# EAGLE design vfd_controller_io (EAGLE 9.6.1)
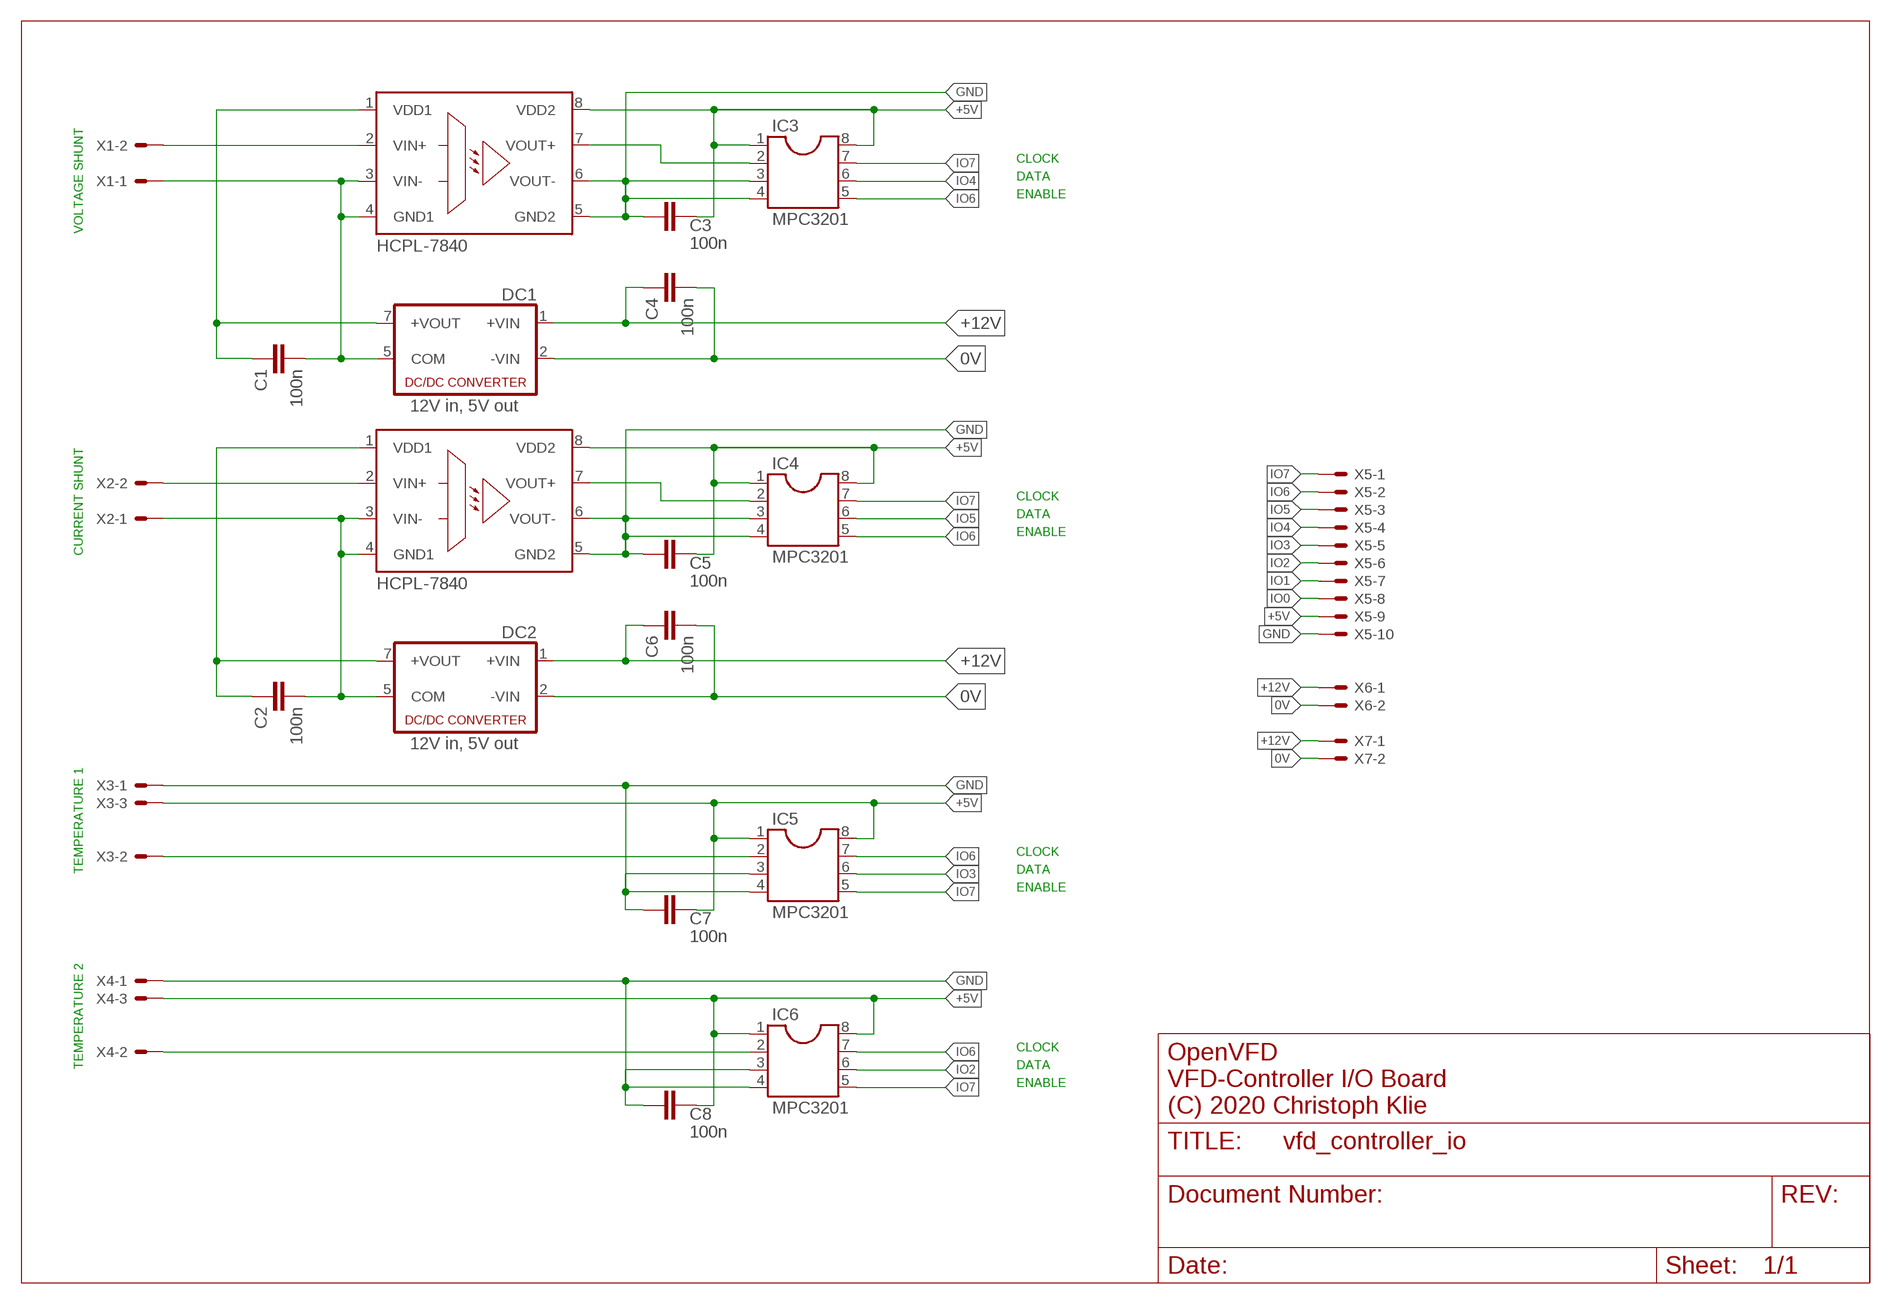
[diagram p0: schematic, sheet 1]

## Parts
C1  100n  C-EU050-025X075  [C050-025X075]
C2  100n  C-EU050-025X075  [C050-025X075]
C3  100n  C-EU050-025X075  [C050-025X075]
C4  100n  C-EU025-024X044  [C025-024X044]
C5  100n  C-EU050-025X075  [C050-025X075]
C6  100n  C-EU025-024X044  [C025-024X044]
C7  100n  C-EU050-025X075  [C050-025X075]
C8  100n  C-EU050-025X075  [C050-025X075]
DC1  12V in, 5V out  MEV  [MEV]
DC2  12V in, 5V out  MEV  [MEV]
IC1  HCPL-7840  HCPL-7800  [DIL08]
IC2  HCPL-7840  HCPL-7800  [DIL08]
IC3  MPC3201  DIL8  [DIL08]
IC4  MPC3201  DIL8  [DIL08]
IC5  MPC3201  DIL8  [DIL08]
IC6  MPC3201  DIL8  [DIL08]
X1  JST-XH-02-PIN-LONG-PAD  [JST-XH-02-PACKAGE-LONG-PAD]
X2  JST-XH-02-PIN-LONG-PAD  [JST-XH-02-PACKAGE-LONG-PAD]
X3  JST-XH-03-PIN-LONG-PAD  [JST-XH-03-PACKAGE-LONG-PAD]
X4  JST-XH-03-PIN-LONG-PAD  [JST-XH-03-PACKAGE-LONG-PAD]
X5  JST-XH-10-PIN-LONG-PAD  [JST-XH-10-PACKAGE-LONG-PAD]
X6  JST-XH-02-PIN-LONG-PAD  [JST-XH-02-PACKAGE-LONG-PAD]
X7  JST-XH-02-PIN-LONG-PAD  [JST-XH-02-PACKAGE-LONG-PAD]

## Nets
0V: C4.2 C6.2 DC1.2(-VIN) DC2.2(-VIN) X6.2 X7.2
+5V: C3.2 C5.2 C7.2 C8.2 IC1.8(VDD2) IC2.8(VDD2) IC3.1 IC3.8 IC4.1 IC4.8 IC5.1 IC5.8 IC6.1 IC6.8 X3.3 X4.3 X5.9
+12V: C4.1 C6.1 DC1.1(+VIN) DC2.1(+VIN) X6.1 X7.1
GND: C3.1 C5.1 C7.1 C8.1 IC1.5(GND2) IC1.6(VOUT-) IC2.5(GND2) IC2.6(VOUT-) IC3.3 IC3.4 IC4.3 IC4.4 IC5.3 IC5.4 IC6.3 IC6.4 X3.1 X4.1 X5.10
IO0: X5.8
IO1: X5.7
IO2: IC6.6 X5.6
IO3: IC5.6 X5.5
IO4: IC3.6 X5.4
IO5: IC4.6 X5.3
IO6: IC3.5 IC4.5 IC5.7 IC6.7 X5.2
IO7: IC3.7 IC4.7 IC5.5 IC6.5 X5.1
N$2: IC6.2 X4.2
N$3: IC5.2 X3.2
N$5: C2.1 DC2.7(+VOUT) IC2.1(VDD1)
N$13: C2.2 DC2.5(COM) IC2.3(VIN-) IC2.4(GND1) X2.1
N$14: IC1.2(VIN+) X1.2
N$17: IC1.7(VOUT+) IC3.2
N$19: C1.2 DC1.5(COM) IC1.3(VIN-) IC1.4(GND1) X1.1
N$21: IC2.2(VIN+) X2.2
N$22: C1.1 DC1.7(+VOUT) IC1.1(VDD1)
N$32: IC2.7(VOUT+) IC4.2

## Notes on the sheet
- VOLTAGE SHUNT
- CLOCK
- DATA
- ENABLE
- CURRENT SHUNT
- CLOCK
- DATA
- ENABLE
- TEMPERATURE 1
- CLOCK
- DATA
- ENABLE
- TEMPERATURE 2
- CLOCK
- OpenVFD
- DATA
- ENABLE | VFD-Controller I/O Board
- (C) 2020 Christoph Klie

## Library data of the parts
C1-C3 C5 C7 C8 = rcl:C-EU: CAPACITOR, European symbol; R: MKS2-63 100N; SPICEPREFIX: C
C4 C6 = rcl:C-EU: CAPACITOR, European symbol; R: MKS02-63 100N; SPICEPREFIX: C
DC1 DC2 = custom:MEV: DC-DC CONVERTER; R: MEV1S1205SC
IC1 IC2 = avago:HCPL-7800: Isolation Amplifer Source: http://www.avagotech.com/docs/AV02-0410EN; MPN: HCPL-7800A#500; OC_FARNELL: 459446; OC_NEWARK: 05M6395
IC3-IC6 = ic-package:DIL8: Dual In Line / Socket; R: MPC 3201-CI/P
X1 X2 X6 X7 =  JST_XH_connnectors:JST-XH-02-PIN: JST XH Connector 2 Pin Wire to board connector. Pitch: 2,54 mm, (0.100") Number of pins: 2 Created by Rembrandt Electronics www.rembrandtelectronics.com; R: JST XH2P ST
X3 X4 =  JST_XH_connnectors:JST-XH-03-PIN: JST XH Connector 2 Pin Wire to board connector. Pitch: 2,54 mm, (0.100") Number of pins: 3 Created by Rembrandt Electronics www.rembrandtelectronics.com; R: JST XH3P ST
X5 =  JST_XH_connnectors:JST-XH-10-PIN: JST XH Connector 2 Pin Wire to board connector. Pitch: 2,54 mm, (0.100") Number of pins: 10 Created by Rembrandt Electronics www.rembrandtelectronics.com; R: JST XH10P ST

## Board
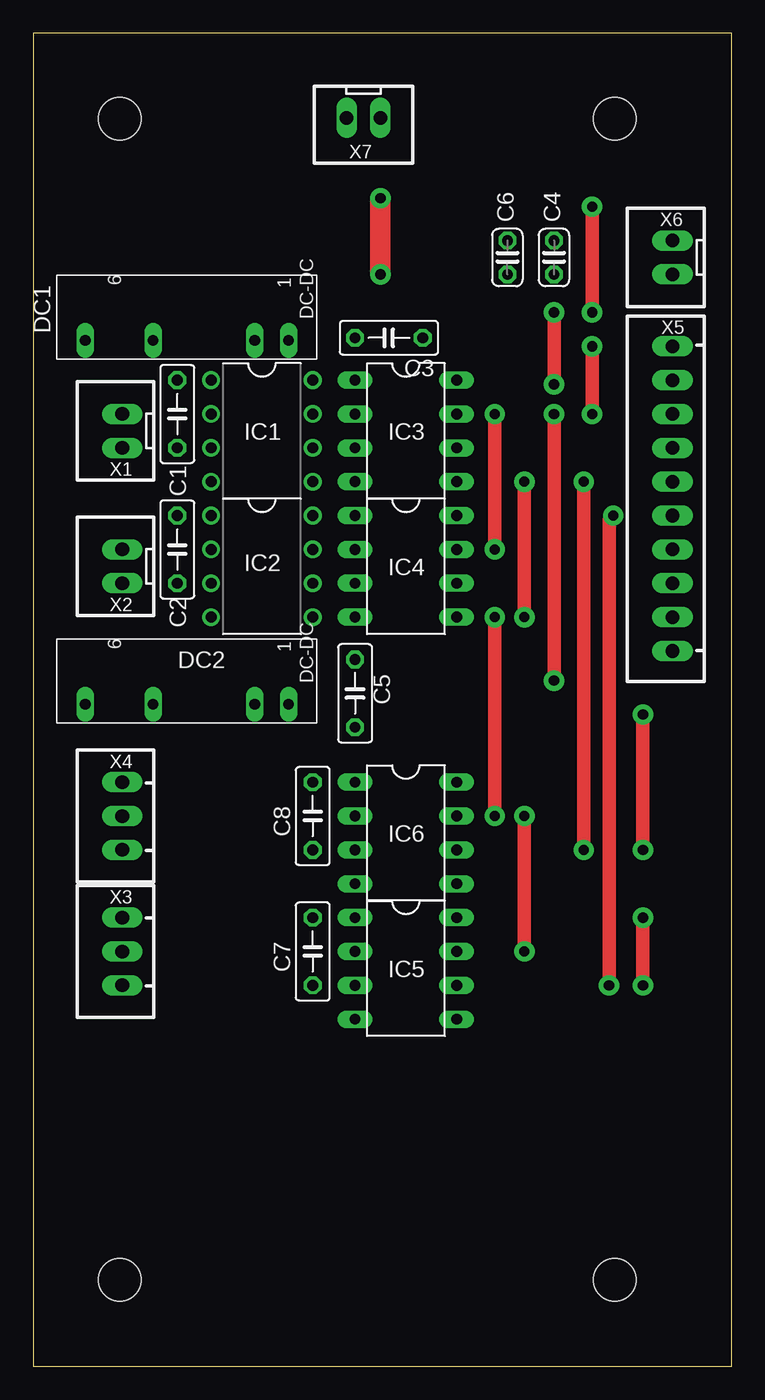
[diagram p1: board, top side]
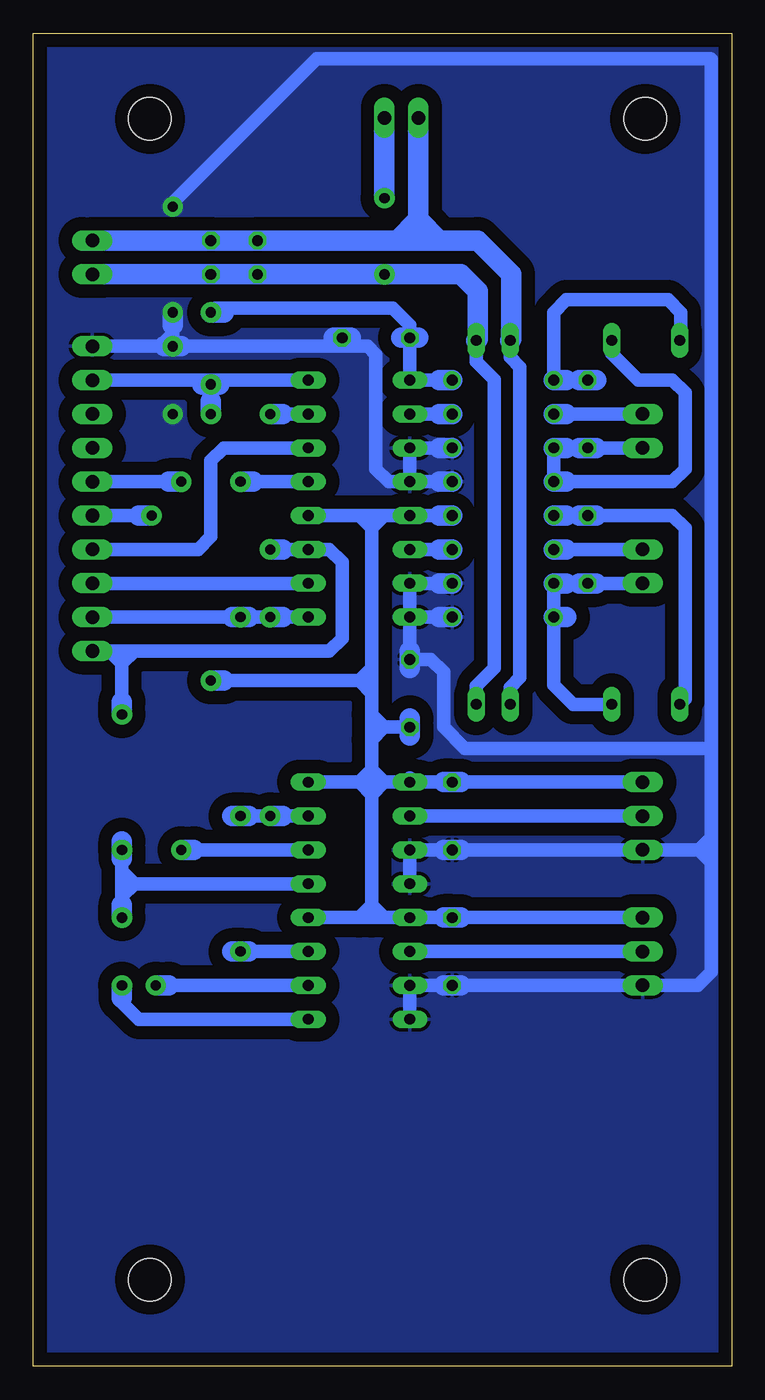
[diagram p2: board, bottom side, seen from below]

Size 52.37 x 100 mm. Coordinates in mm from the lower left corner, seen from the top.
Outline: 0,0 52.37,0 52.37,100 0,100 0,0
Copper layers (1*16): Top 0.035mm / dielectric 1.5mm / Bottom 0.035mm
Design rules "default": minimum track width 6mil, minimum drill 0.35mm, track to track 6mil, track to pad 6mil, pad to pad 6mil, via to via 6mil, smd to smd 6mil, copper to edge 40mil, drill to drill 6mil, minimum pad ring 10mil, minimum via ring 8mil, stop-mask expansion 4mil, vias tented up to drill 0mil, thermal gap 10mil
Holes 3.2 mm at 6.48,93.58 43.62,93.58 6.48,6.5 43.62,6.5

### Footprints (pad centres in the part's own frame; a part is rotated, then mirrored left to right if it is on the bottom)
C050-025X075 = drill 0.813 octagon: 1 -2.54,0; 2 2.54,0
C025-024X044 = drill 0.813 octagon: 1 -1.27,0; 2 1.27,0
MEV = drill 0.813 long: 1 -3.683,-6.756; 2 -3.683,-4.216; 5 -3.683,3.404; 7 -3.683,8.484
DIL08 = drill 0.813 pad 1.3: 1 -3.81,-3.81; 2 -1.27,-3.81; 3 1.27,-3.81; 4 3.81,-3.81; 5 3.81,3.81; 6 1.27,3.81; 7 -1.27,3.81; 8 -3.81,3.81
DIL08' = drill 0.813 long: 1 -3.81,-3.81; 2 -1.27,-3.81; 3 1.27,-3.81; 4 3.81,-3.81; 5 3.81,3.81; 6 1.27,3.81; 7 -1.27,3.81; 8 -3.81,3.81
JST-XH-02-PACKAGE-LONG-PAD = drill 1.016 long: 1 -1.27,0; 2 1.27,0
JST-XH-03-PACKAGE-LONG-PAD = drill 1.016 long: 1 -2.54,0; 2 0,0; 3 2.54,0
JST-XH-10-PACKAGE-LONG-PAD = drill 1.016 long: 1 -11.43,0; 2 -8.89,0; 3 -6.35,0; 4 -3.81,0; 5 -1.27,0; 6 1.27,0; 7 3.81,0; 8 6.35,0; 9 8.89,0; 10 11.43,0

### Placement (x,y rotation side)
C1  10.8,71.44 270 top
C2  10.8,61.28 270 top
C3  26.67,77.15 180 top
C4  39.05,83.19 90 top
C5  24.13,50.48 270 top
C6  35.56,83.19 90 top
C7  20.95,31.12 90 top
C8  20.95,41.28 90 top
DC1  12.38,80.65 90 top
DC2  12.38,53.34 90 top
IC1  17.14,70.17 270 top
IC2  17.14,60.01 270 top
IC3  MPC3201  [DIL08']  27.94,70.17 270 top
IC4  MPC3201  [DIL08']  27.94,60.01 270 top
IC5  MPC3201  [DIL08']  27.94,29.84 270 top
IC6  MPC3201  [DIL08']  27.94,40.01 270 top
U$1  [A4L-LOC]  -104.14,-49.85 0 top  (outside the outline)
X1  6.67,70.17 90 top
X2  6.67,60.01 90 top
X3  6.67,31.12 90 top
X4  6.67,41.28 90 top
X5  47.94,65.09 90 top
X6  47.94,83.19 90 top
X7  24.77,93.66 180 top

### Tracks (layer width: path | path; a pad name or v marks a point on that pad's centre or on a via)
0V
  Bottom 1.016: DC2.2 16.6,50.93 15.88,51.65 15.88,74.97 16.6,75.69 DC1.2
  Bottom 1.524: X7.2 23.5,86.04 | 23.5,84.46 23.5,86.04 | 23.5,84.46 25.08,84.46 | 25.08,84.46 C6.2 C4.2 X6.2 | DC1.2 16.51,77.05 16.51,81.91 19.05,84.46 21.91,84.46 | 23.5,84.46 21.91,84.46 | 23.5,86.04 21.91,84.46 | 23.5,86.04 25.08,84.46
+5V  (via drill 0.76 pad 1.52)
  Top 1.016: v39.05,71.44 v39.05,51.43 | v39.05,79.06 v39.05,73.66
  Bottom 1: 21.91,63.82 IC4.1 | 21.91,73.98 IC3.1
  Bottom 1.016: IC3.8 38.1,73.98 | 38.1,73.98 40.01,73.98 | 40.01,73.98 X5.9 | 39.05,72.39 39.05,73.03 | 39.05,73.03 38.42,73.66 38.1,73.98 | 39.05,73.03 39.69,73.66 40.01,73.98 | 27.94,63.82 26.99,62.87 | 27.94,63.82 IC4.8 | 26.99,62.87 26.04,63.82 | IC4.1 26.04,63.82 | 26.04,63.82 27.94,63.82 | X3.3 20.32,33.65 | 21.59,33.65 IC5.1 26.04,33.65 | X4.3 20.32,43.81 | 21.59,43.81 23.81,43.81 24.13,44.13 IC6.1 26.04,43.81 | IC6.8 27.94,43.81 | 27.94,43.81 26.99,43.81 | 26.04,43.81 26.99,43.81 | 26.04,33.65 26.99,33.65 | 26.99,33.65 27.94,33.65 | 27.94,33.65 IC5.8 | 26.99,62.87 26.99,52.39 | 26.99,52.39 26.99,50.48 | 26.99,50.48 26.99,48.9 | 26.99,48.9 26.99,46.99 | 26.99,46.99 26.99,44.77 | IC3.1 C3.2 24.13,78.11 25.4,79.37 38.73,79.37 v39.05,79.06 | 26.99,43.81 26.99,44.77 | 26.99,43.81 26.99,42.86 | 26.99,34.61 26.99,42.86 | 26.99,33.65 26.99,34.61 | 26.99,34.61 26.04,33.65 | 26.99,34.61 27.94,33.65 | 26.99,42.86 26.04,43.81 | 26.99,42.86 27.94,43.81 | 26.99,44.77 26.04,43.81 | 26.99,44.77 27.94,43.81 | C5.2 26.04,47.94 | 26.99,48.9 26.04,47.94 | 26.04,47.94 26.99,46.99 | 26.99,50.48 27.94,51.43 | 38.1,51.43 27.94,51.43 | 27.94,51.43 26.99,52.39
  Bottom 1.524: IC2.8 21.91,63.82 | 20.32,33.65 C7.2 21.59,33.65 | 20.32,43.81 C8.2 21.59,43.81 | 24.13,47.31 C5.2 24.13,48.58 | IC1.8 21.91,73.98 | 23.5,77.15 C3.2 24.77,77.15 | v39.05,79.06 38.1,79.06 | 38.42,73.66 v39.05,73.66 39.69,73.66 | v39.05,71.44 39.05,72.39 | v39.05,51.43 38.1,51.43
+12V  (via drill 0.76 pad 1.52)
  Top 1.524: v26.04,87.63 v26.04,81.91
  Bottom 1.016: DC2.1 19.14,51.03 17.78,52.39 17.78,74.02 19.14,75.37 DC1.1
  Bottom 1.524: C6.1 C4.1 X6.1 | DC1.1 19.05,77.05 19.05,80.65 20.32,81.91 C6.1 | X7.1 v26.04,87.63 | v26.04,81.91 C6.1
GND  (via drill 0.76 pad 1.52)
  Top 1.016: v41.91,76.52 v41.91,71.44 | v41.91,79.06 v41.91,87
  Bottom 1: 21.91,56.2 IC4.4 | 21.91,58.74 IC4.3 | 21.91,68.9 IC3.3 | 21.91,66.36 IC3.4
  Bottom 1.016: IC3.3 IC3.4 25.72,66.36 26.67,67.31 26.67,75.88 27.3,76.52 28.58,76.52 | IC4.3 IC4.4 24.13,53.66 | 46.36,76.52 X5.10 42.86,76.52 | 42.86,76.52 42.55,76.52 | 41.91,78.11 41.91,77.47 | v41.91,76.52 41.91,77.47 | 41.91,77.47 42.86,76.52 | 1.52,39.69 1.52,46.36 | 20.32,28.57 X3.1 2.54,28.57 1.52,29.59 1.52,37.78 | 20.32,38.73 X4.1 2.48,38.73 | IC6.4 IC6.3 21.59,38.73 | IC5.4 IC5.3 21.59,28.57 | 1.52,39.69 1.52,37.78 | 2.48,38.73 1.52,39.69 | 2.48,38.73 1.52,37.78 | 28.58,76.52 C3.1 29.85,76.52 | 41.27,76.52 29.85,76.52 | 28.58,76.52 29.85,76.52 | 1.52,46.36 20,46.36 21.59,47.94 21.59,52.07 22.54,53.02 C5.1 | v41.91,87 41.91,87.31 31.11,98.11 1.59,98.11 1.52,98.04 1.52,46.36
  Bottom 1.524: IC2.6 21.91,58.74 | IC2.5 21.91,56.2 | 20.32,28.57 C7.1 21.59,28.57 | 20.32,38.73 C8.1 21.59,38.73 | 24.13,52.39 C5.1 24.13,53.66 | IC1.5 21.91,66.36 | IC1.6 21.91,68.9 | 28.58,77.15 C3.1 29.85,77.15 | v41.91,79.06 41.91,78.11 | 41.27,76.52 v41.91,76.52 42.55,76.52
  pour Bottom (isolate 1): 0,100.01 51.43,100.01 51.43,0 0,0
IO2  (via drill 0.76 pad 1.52)
  Top 1.016: v41.27,66.36 v41.27,38.73
  Bottom 1.016: X5.6 42.23,66.36 | IC6.6 40.32,38.73
  Bottom 1.524: v41.27,66.36 42.23,66.36 | v41.27,38.73 40.32,38.73
IO3  (via drill 0.76 pad 1.52)
  Top 1.016: v43.5,63.82 43.18,63.5 v43.18,28.57
  Bottom 1.016: X5.5 44.45,63.82 | IC5.6 42.23,28.57
  Bottom 1.524: v43.5,63.82 44.45,63.82 | v43.18,28.57 42.23,28.57
IO4
  Bottom 1.016: IC3.6 38.1,68.9 39.05,67.95 39.05,62.23 40.01,61.28 X5.4
IO5
  Bottom 1.016: IC4.6 X5.3
IO6  (via drill 0.76 pad 1.52)
  Top 1.016: v36.83,56.2 v36.83,66.36 | v34.61,56.2 v34.61,41.28 | v36.83,41.28 v36.83,31.12
  Bottom 1.016: IC3.5 35.88,66.36 | IC4.5 33.65,56.2 | v34.61,56.2 36.2,56.2 | 37.46,56.2 X5.2 | IC6.7 33.65,41.28 | v34.61,41.28 36.2,41.28 | 36.2,31.12 IC5.7
  Bottom 1.524: v36.83,66.36 35.88,66.36 | v34.61,56.2 33.65,56.2 | 36.2,56.2 v36.83,56.2 37.46,56.2 | v34.61,41.28 33.65,41.28 | 36.2,41.28 v36.83,41.28 37.46,41.28 | 36.2,31.12 v36.83,31.12 37.46,31.12
IO7  (via drill 0.76 pad 1.52)
  Top 1.016: v34.61,71.44 v34.61,61.28 | v45.72,48.9 v45.72,38.73 | v45.72,28.57 v45.72,33.65
  Bottom 1.016: 33.65,61.28 IC4.7 30.16,61.28 29.21,60.32 29.21,54.61 30.16,53.66 44.77,53.66 | IC3.7 33.65,71.44 | X5.1 46.67,53.66 | 46.67,53.66 45.4,53.66 | 45.4,53.66 44.77,53.66 | IC5.5 44.45,26.03 45.72,27.31 45.72,27.62 45.72,27.94 | 45.4,53.66 45.72,53.34 45.72,52.7 | 45.72,35.24 45.72,37.15 | 45.72,37.15 44.77,36.2 | IC6.5 44.77,36.2 | 44.77,36.2 45.72,35.24 | 45.72,52.7 44.77,53.66 | 45.72,52.7 46.67,53.66 | 45.72,37.15 45.72,38.1 | 45.72,49.85 45.72,52.7 | 45.72,34.61 45.72,35.24
  Bottom 1.524: v34.61,71.44 33.65,71.44 | v34.61,61.28 33.65,61.28 | v45.72,48.9 45.72,49.85 | 45.72,39.37 v45.72,38.73 45.72,38.1 | v45.72,28.57 45.72,27.62 | v45.72,33.65 45.72,34.61
N$2
  Bottom 1.016: X4.2 IC6.2
N$3
  Bottom 1.016: X3.2 IC5.2
N$5
  Bottom 1.016: 11.43,63.82 12.38,63.82 | DC2.7 3.49,50.06 3.49,62.87 4.44,63.82 10.16,63.82
  Bottom 1.524: IC2.1 12.38,63.82 | 10.16,63.82 C2.1 11.43,63.82
N$13
  Bottom 1: IC2.3 IC2.4 13.42,56.11
  Bottom 1.016: 11.43,58.74 12.38,58.74 | 10.16,58.74 X2.1 | DC2.5 11.87,49.66 13.33,51.12 IC2.4
  Bottom 1.524: IC2.4 12.38,56.2 | IC2.3 12.38,58.74 | 10.16,58.74 C2.2 11.43,58.74
N$14
  Bottom 1.016: X1.2 12.38,71.44
  Bottom 1.524: IC1.2 12.38,71.44
N$17
  Bottom 1: 21.91,71.44 IC3.2
  Bottom 1.524: IC1.7 21.91,71.44
N$19
  Bottom 1: IC1.4 IC1.3
  Bottom 1.016: 12.38,66.36 4.44,66.36 3.49,67.31 3.49,73.03 4.44,73.98 6.98,73.98 8.98,75.97 DC1.5 | X1.1 10.16,68.9 | 11.43,68.9 12.38,68.9
  Bottom 1.524: IC1.4 12.38,66.36 | IC1.3 12.38,68.9 | 10.16,68.9 C1.2 11.43,68.9
N$21
  Bottom 1.016: X2.2 12.38,61.28
  Bottom 1.524: IC2.2 12.38,61.28
N$22
  Bottom 1.016: 11.11,73.98 11.43,73.98 12.38,73.98 | DC1.7 3.81,77.05 3.81,79.06 4.76,80.01 12.38,80.01 13.33,79.06 IC1.1
  Bottom 1.524: IC1.1 12.38,73.98 | C1.1 10.16,73.98 | C1.1 11.11,73.98 | C1.1 11.43,73.98
N$32
  Bottom 1: 21.91,61.28 IC4.2
  Bottom 1.524: IC2.7 21.91,61.28
(copper drawn outside any net)
  shapes: Bottom circle x4

### Text on the board
Document: OpenVFD | VFD-Conroller I/O Board | (C) 2020 Christoph Klie | Version 1.0 | [1/1]